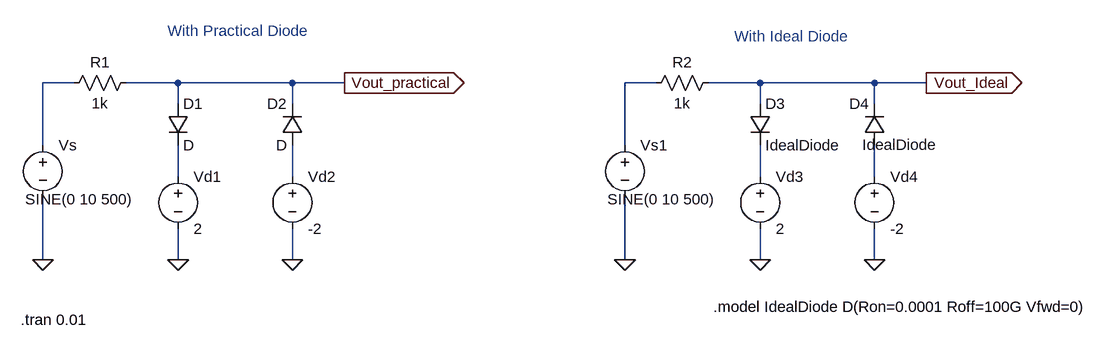
[diagram p0: schematic Draft2.asc]
Draft2.asc, the LTspice schematic file:
Version 4
SHEET 1 1860 680
WIRE 240 16 192 16
WIRE 400 16 320 16
WIRE 576 16 400 16
WIRE 656 16 576 16
WIRE 1136 16 1088 16
WIRE 1296 16 1216 16
WIRE 1472 16 1296 16
WIRE 1552 16 1472 16
WIRE 400 48 400 16
WIRE 576 48 576 16
WIRE 1296 48 1296 16
WIRE 1472 48 1472 16
WIRE 192 112 192 16
WIRE 1088 112 1088 16
WIRE 400 160 400 112
WIRE 576 160 576 112
WIRE 1296 160 1296 112
WIRE 1472 160 1472 112
WIRE 192 288 192 192
WIRE 400 288 400 240
WIRE 576 288 576 240
WIRE 1088 288 1088 192
WIRE 1296 288 1296 240
WIRE 1472 288 1472 240
FLAG 192 288 0
FLAG 400 288 0
FLAG 576 288 0
FLAG 656 16 Vout_practical
IOPIN 656 16 Out
FLAG 1088 288 0
FLAG 1296 288 0
FLAG 1472 288 0
FLAG 1552 16 Vout_Ideal
IOPIN 1552 16 Out
SYMBOL voltage 192 96 R0
WINDOW 3 -27 99 Left 2
WINDOW 123 0 0 Left 0
WINDOW 39 0 0 Left 0
SYMATTR InstName Vs
SYMATTR Value SINE(0 10 500)
SYMBOL diode 384 48 R0
SYMATTR InstName D1
SYMBOL diode 592 112 R180
WINDOW 0 24 64 Left 2
WINDOW 3 24 0 Left 2
SYMATTR InstName D2
SYMBOL voltage 400 144 R0
WINDOW 123 0 0 Left 0
WINDOW 39 0 0 Left 0
SYMATTR InstName Vd1
SYMATTR Value 2
SYMBOL voltage 576 144 R0
SYMATTR InstName Vd2
SYMATTR Value -2
SYMBOL res 336 0 R90
WINDOW 0 0 56 VBottom 2
WINDOW 3 32 56 VTop 2
SYMATTR InstName R1
SYMATTR Value 1k
SYMBOL voltage 1088 96 R0
WINDOW 3 -27 99 Left 2
WINDOW 123 0 0 Left 0
WINDOW 39 0 0 Left 0
SYMATTR InstName Vs1
SYMATTR Value SINE(0 10 500)
SYMBOL diode 1280 48 R0
SYMATTR InstName D3
SYMATTR Value IdealDiode
SYMBOL diode 1488 112 R180
WINDOW 0 24 64 Left 2
WINDOW 3 -81 1 Left 2
SYMATTR InstName D4
SYMATTR Value IdealDiode
SYMBOL voltage 1296 144 R0
WINDOW 123 0 0 Left 0
WINDOW 39 0 0 Left 0
SYMATTR InstName Vd3
SYMATTR Value 2
SYMBOL voltage 1472 144 R0
SYMATTR InstName Vd4
SYMATTR Value -2
SYMBOL res 1232 0 R90
WINDOW 0 0 56 VBottom 2
WINDOW 3 32 56 VTop 2
SYMATTR InstName R2
SYMATTR Value 1k
TEXT 1224 360 Left 2 !.model IdealDiode D(Ron=0.0001 Roff=100G Vfwd=0)
TEXT 384 -64 Left 2 ;With Practical Diode
TEXT 1256 -56 Left 2 ;With Ideal Diode
TEXT 158 380 Left 2 !.tran 0.01

The netlist it stands for:
* Draft2.asc
Vs N001 0 SINE(0 10 500)
D1 Vout_practical N003 D
D2 N004 Vout_practical D
Vd1 N003 0 2
Vd2 N004 0 -2
R1 Vout_practical N001 1k
Vs1 N002 0 SINE(0 10 500)
D3 Vout_Ideal N005 IdealDiode
D4 N006 Vout_Ideal IdealDiode
Vd3 N005 0 2
Vd4 N006 0 -2
R2 Vout_Ideal N002 1k
.model D D
.lib standard.dio
.model IdealDiode D(Ron=0.0001 Roff=100G Vfwd=0)
* With Practical Diode
* With Ideal Diode
.tran 0.01
.backanno
.end